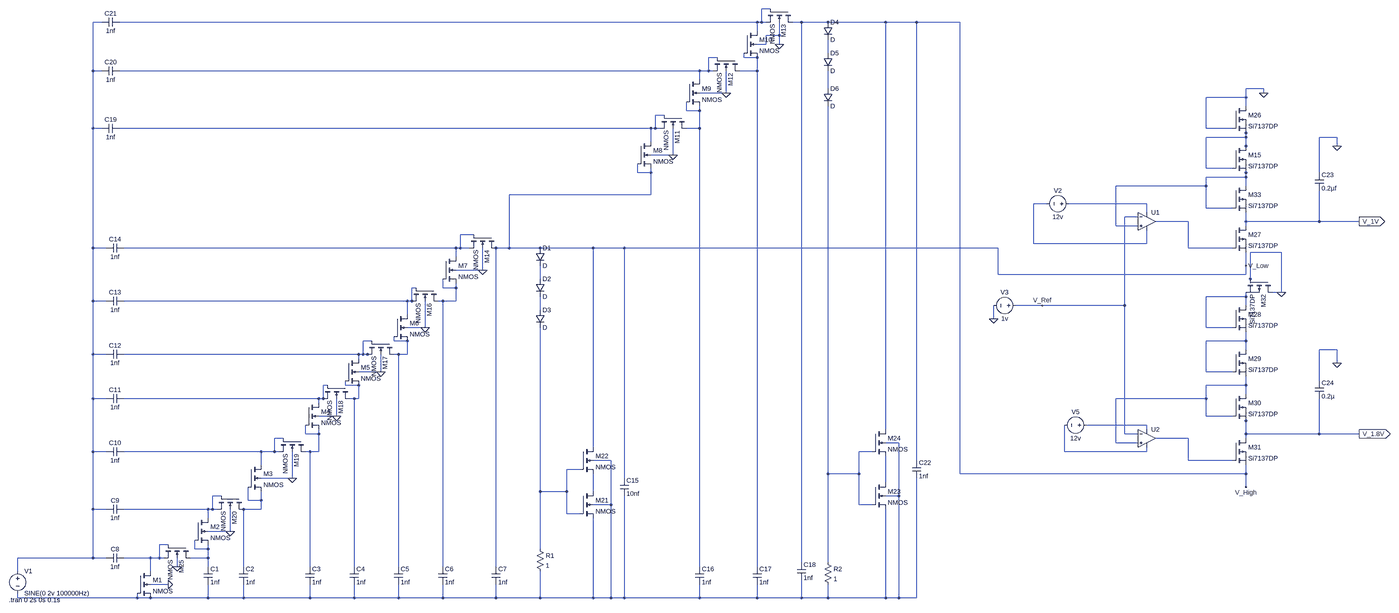
[diagram p0: schematic rectifier.asc, whole sheet]
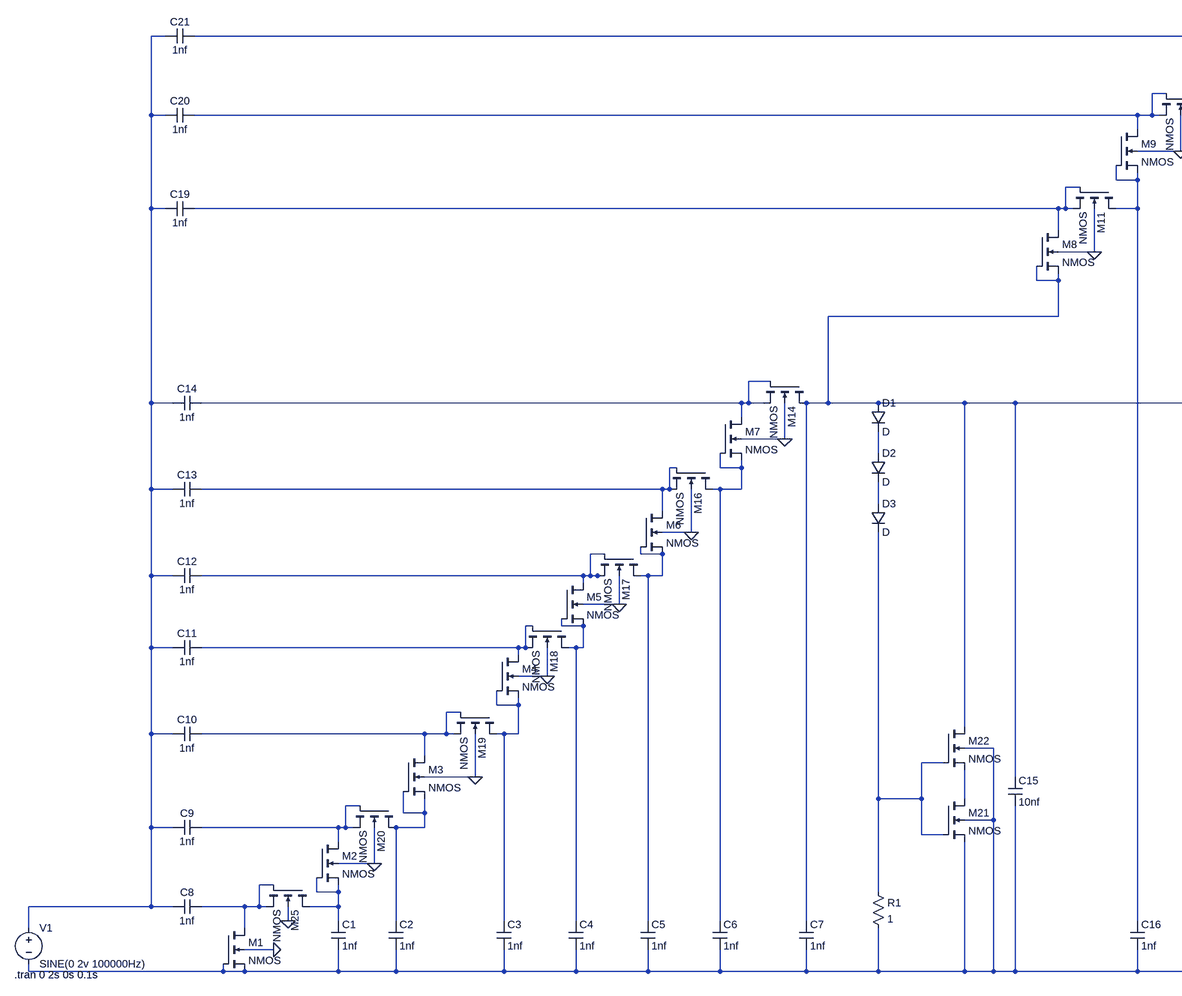
[diagram p1: schematic rectifier.asc, part, row 1 of 1, column 1 of 2]
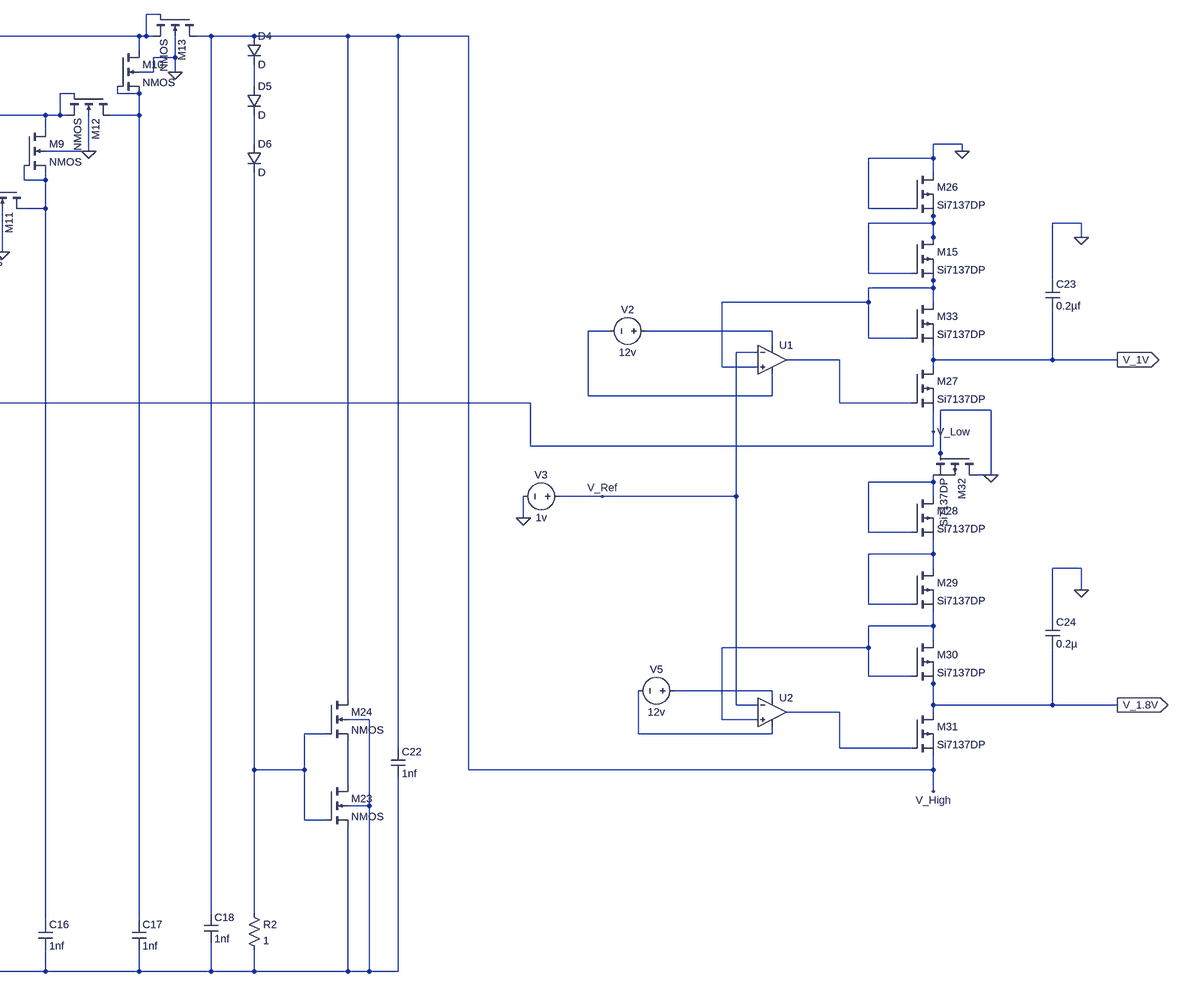
[diagram p2: schematic rectifier.asc, part, row 1 of 1, column 2 of 2]
rectifier.asc, the LTspice schematic file:
Version 4
SHEET 1 5596 680
WIRE 2400 -1856 2368 -1856
WIRE -16 -1808 -48 -1808
WIRE 2352 -1808 48 -1808
WIRE 2368 -1808 2368 -1856
WIRE 2368 -1808 2352 -1808
WIRE 2384 -1808 2368 -1808
WIRE 2512 -1808 2480 -1808
WIRE 2608 -1808 2512 -1808
WIRE 2816 -1808 2608 -1808
WIRE 2928 -1808 2816 -1808
WIRE 3376 -1808 2928 -1808
WIRE 2352 -1776 2352 -1808
WIRE 2432 -1760 2432 -1808
WIRE 2432 -1760 2384 -1760
WIRE 2384 -1728 2384 -1760
WIRE 2384 -1728 2352 -1728
WIRE 2432 -1728 2432 -1760
WIRE 2608 -1696 2608 -1744
WIRE 2208 -1680 2176 -1680
WIRE 2304 -1680 2304 -1696
WIRE 2352 -1680 2304 -1680
WIRE -48 -1632 -48 -1808
WIRE -16 -1632 -48 -1632
WIRE 2144 -1632 48 -1632
WIRE 2176 -1632 2176 -1680
WIRE 2176 -1632 2144 -1632
WIRE 2192 -1632 2176 -1632
WIRE 2352 -1632 2352 -1680
WIRE 2352 -1632 2288 -1632
WIRE 2144 -1600 2144 -1632
WIRE 2608 -1568 2608 -1632
WIRE 4752 -1568 4688 -1568
WIRE 2240 -1552 2240 -1632
WIRE 2240 -1552 2144 -1552
WIRE 4752 -1552 4752 -1568
WIRE 4688 -1536 4688 -1568
WIRE 4688 -1536 4544 -1536
WIRE 4688 -1504 4688 -1536
WIRE 2096 -1488 2096 -1520
WIRE 2144 -1488 2144 -1504
WIRE 2144 -1488 2096 -1488
WIRE 2016 -1472 1984 -1472
WIRE -48 -1424 -48 -1632
WIRE -16 -1424 -48 -1424
WIRE 1968 -1424 48 -1424
WIRE 1984 -1424 1984 -1472
WIRE 1984 -1424 1968 -1424
WIRE 2000 -1424 1984 -1424
WIRE 2144 -1424 2144 -1488
WIRE 2144 -1424 2096 -1424
WIRE 4544 -1424 4544 -1536
WIRE 4640 -1424 4544 -1424
WIRE 4688 -1408 4688 -1424
WIRE 4688 -1392 4688 -1408
WIRE 4688 -1392 4544 -1392
WIRE 5024 -1392 4960 -1392
WIRE 1968 -1376 1968 -1424
WIRE 4688 -1360 4688 -1392
WIRE 5024 -1360 5024 -1392
WIRE 4688 -1344 4688 -1360
WIRE 2048 -1328 2048 -1424
WIRE 2048 -1328 1968 -1328
WIRE 4544 -1280 4544 -1392
WIRE 4640 -1280 4544 -1280
WIRE 1920 -1264 1920 -1296
WIRE 1968 -1264 1968 -1280
WIRE 1968 -1264 1920 -1264
WIRE 4688 -1264 4688 -1280
WIRE 4960 -1264 4960 -1392
WIRE 4688 -1248 4688 -1264
WIRE 4688 -1248 4544 -1248
WIRE 4544 -1216 4544 -1248
WIRE 4544 -1216 4176 -1216
WIRE 4688 -1216 4688 -1248
WIRE 1968 -1184 1968 -1264
WIRE 1968 -1184 1456 -1184
WIRE 3920 -1152 3872 -1152
WIRE 4288 -1152 4000 -1152
WIRE 4544 -1136 4544 -1216
WIRE 4640 -1136 4544 -1136
WIRE 4288 -1120 4288 -1152
WIRE 4256 -1104 4208 -1104
WIRE 4480 -1088 4320 -1088
WIRE 4688 -1088 4688 -1120
WIRE 4960 -1088 4960 -1200
WIRE 4960 -1088 4688 -1088
WIRE 5104 -1088 4960 -1088
WIRE 4176 -1072 4176 -1216
WIRE 4256 -1072 4176 -1072
WIRE 4688 -1072 4688 -1088
WIRE 1328 -1040 1280 -1040
WIRE 3872 -1008 3872 -1152
WIRE 4288 -1008 4288 -1056
WIRE 4288 -1008 3872 -1008
WIRE -48 -992 -48 -1424
WIRE 0 -992 -48 -992
WIRE 1264 -992 64 -992
WIRE 1280 -992 1280 -1040
WIRE 1280 -992 1264 -992
WIRE 1312 -992 1280 -992
WIRE 1456 -992 1456 -1184
WIRE 1456 -992 1408 -992
WIRE 1568 -992 1456 -992
WIRE 1760 -992 1568 -992
WIRE 1872 -992 1760 -992
WIRE 3744 -992 1872 -992
WIRE 4480 -992 4480 -1088
WIRE 4640 -992 4480 -992
WIRE 4816 -976 4704 -976
WIRE 1264 -960 1264 -992
WIRE 4688 -928 4688 -976
WIRE 1360 -912 1360 -992
WIRE 1360 -912 1264 -912
WIRE 3744 -896 3744 -992
WIRE 4688 -896 4688 -928
WIRE 4688 -896 3744 -896
WIRE 1568 -880 1568 -928
WIRE 4704 -880 4704 -976
WIRE 4704 -864 4704 -880
WIRE 1120 -848 1104 -848
WIRE 1216 -848 1216 -880
WIRE 1264 -848 1264 -864
WIRE 1264 -848 1216 -848
WIRE 4816 -832 4816 -976
WIRE 4816 -832 4784 -832
WIRE 4688 -816 4688 -832
WIRE 4688 -816 4544 -816
WIRE -48 -800 -48 -992
WIRE 0 -800 -48 -800
WIRE 1088 -800 64 -800
WIRE 1104 -800 1104 -848
WIRE 1104 -800 1088 -800
WIRE 1216 -800 1200 -800
WIRE 1264 -800 1264 -848
WIRE 1264 -800 1216 -800
WIRE 3904 -784 3808 -784
WIRE 4208 -784 4208 -1104
WIRE 4208 -784 3904 -784
WIRE 4688 -784 4688 -816
WIRE 1568 -768 1568 -816
WIRE 1088 -752 1088 -800
WIRE 3728 -736 3728 -784
WIRE 1152 -704 1152 -800
WIRE 1152 -704 1088 -704
WIRE 4544 -704 4544 -816
WIRE 4640 -704 4544 -704
WIRE 960 -656 928 -656
WIRE 1040 -656 1040 -672
WIRE 1088 -656 1040 -656
WIRE 4688 -656 4688 -688
WIRE 4688 -656 4544 -656
WIRE 4688 -624 4688 -656
WIRE 5024 -624 4960 -624
WIRE -48 -608 -48 -800
WIRE 0 -608 -48 -608
WIRE 912 -608 64 -608
WIRE 928 -608 928 -656
WIRE 928 -608 912 -608
WIRE 944 -608 928 -608
WIRE 960 -608 944 -608
WIRE 1056 -608 1040 -608
WIRE 1088 -608 1088 -656
WIRE 1088 -608 1056 -608
WIRE 912 -592 912 -608
WIRE 5024 -576 5024 -624
WIRE 992 -544 992 -608
WIRE 992 -544 912 -544
WIRE 4544 -544 4544 -656
WIRE 4640 -544 4544 -544
WIRE 4960 -512 4960 -624
WIRE 800 -496 784 -496
WIRE 864 -496 864 -512
WIRE 912 -496 864 -496
WIRE 4688 -496 4688 -528
WIRE 4688 -496 4544 -496
WIRE 4688 -464 4688 -496
WIRE -48 -448 -48 -608
WIRE 0 -448 -48 -448
WIRE 768 -448 64 -448
WIRE 784 -448 784 -496
WIRE 784 -448 768 -448
WIRE 896 -448 880 -448
WIRE 912 -448 912 -496
WIRE 912 -448 896 -448
WIRE 4544 -448 4544 -496
WIRE 4544 -448 4176 -448
WIRE 768 -432 768 -448
WIRE 832 -384 832 -448
WIRE 832 -384 768 -384
WIRE 4544 -384 4544 -448
WIRE 4640 -384 4544 -384
WIRE 4688 -368 4688 -384
WIRE 4288 -352 4064 -352
WIRE 2816 -336 2816 -1808
WIRE 4288 -336 4288 -352
WIRE 720 -320 720 -352
WIRE 768 -320 768 -336
WIRE 768 -320 720 -320
WIRE 4208 -320 4208 -784
WIRE 4256 -320 4208 -320
WIRE 4688 -320 4688 -368
WIRE 4960 -320 4960 -448
WIRE 4960 -320 4688 -320
WIRE 5104 -320 4960 -320
WIRE 640 -304 608 -304
WIRE 4480 -304 4320 -304
WIRE 4688 -304 4688 -320
WIRE 2864 -288 2816 -288
WIRE 4176 -288 4176 -448
WIRE 4256 -288 4176 -288
WIRE 1760 -272 1760 -992
WIRE -48 -256 -48 -448
WIRE 0 -256 -48 -256
WIRE 560 -256 64 -256
WIRE 608 -256 608 -304
WIRE 608 -256 560 -256
WIRE 624 -256 608 -256
WIRE 736 -256 720 -256
WIRE 768 -256 768 -320
WIRE 768 -256 736 -256
WIRE 2768 -256 2720 -256
WIRE 3984 -256 3984 -352
WIRE 4288 -256 4288 -272
WIRE 4288 -256 3984 -256
WIRE 1824 -224 1760 -224
WIRE 2928 -224 2928 -1808
WIRE 4480 -224 4480 -304
WIRE 4640 -224 4480 -224
WIRE 560 -208 560 -256
WIRE 1712 -192 1664 -192
WIRE 2608 -176 2608 -1504
WIRE 2720 -176 2720 -256
WIRE 2720 -176 2608 -176
WIRE 3376 -176 3376 -1808
WIRE 4688 -176 4688 -208
WIRE 4688 -176 3376 -176
WIRE 672 -160 672 -256
WIRE 672 -160 560 -160
WIRE 1872 -160 1872 -992
WIRE 2816 -144 2816 -240
WIRE 4688 -128 4688 -176
WIRE 1568 -112 1568 -704
WIRE 1664 -112 1664 -192
WIRE 1664 -112 1568 -112
WIRE 1760 -112 1760 -176
WIRE 416 -96 384 -96
WIRE 2864 -96 2864 -288
WIRE 2864 -96 2816 -96
WIRE 512 -80 512 -128
WIRE 560 -80 560 -112
WIRE 560 -80 512 -80
WIRE 1824 -64 1824 -224
WIRE 1824 -64 1760 -64
WIRE 2720 -64 2720 -176
WIRE 2768 -64 2720 -64
WIRE -48 -48 -48 -256
WIRE 0 -48 -48 -48
WIRE 368 -48 64 -48
WIRE 384 -48 384 -96
WIRE 384 -48 368 -48
WIRE 400 -48 384 -48
WIRE 560 -48 560 -80
WIRE 560 -48 496 -48
WIRE 1664 -32 1664 -112
WIRE 1712 -32 1664 -32
WIRE 368 -16 368 -48
WIRE 448 32 448 -48
WIRE 448 32 368 32
WIRE 224 80 192 80
WIRE 320 96 320 64
WIRE 368 96 368 80
WIRE 368 96 320 96
WIRE 1568 96 1568 -112
WIRE -48 128 -48 -48
WIRE -48 128 -320 128
WIRE 0 128 -48 128
WIRE 160 128 64 128
WIRE 192 128 192 80
WIRE 192 128 160 128
WIRE 208 128 192 128
WIRE 368 128 368 96
WIRE 368 128 304 128
WIRE 2512 144 2512 -1808
WIRE 2608 144 2608 -176
WIRE 256 160 256 128
WIRE 368 160 368 128
WIRE 496 160 496 -48
WIRE 736 160 736 -256
WIRE 896 160 896 -448
WIRE 1056 160 1056 -608
WIRE 1216 160 1216 -800
WIRE 1408 160 1408 -992
WIRE 2144 160 2144 -1424
WIRE 2352 160 2352 -1632
WIRE -320 176 -320 128
WIRE 160 176 160 128
WIRE 224 224 160 224
WIRE -320 272 -320 256
WIRE 112 272 112 256
WIRE 112 272 -320 272
WIRE 160 272 112 272
WIRE 368 272 368 224
WIRE 368 272 160 272
WIRE 496 272 496 224
WIRE 496 272 368 272
WIRE 736 272 736 224
WIRE 736 272 496 272
WIRE 896 272 896 224
WIRE 896 272 736 272
WIRE 1056 272 1056 224
WIRE 1056 272 896 272
WIRE 1216 272 1216 224
WIRE 1216 272 1056 272
WIRE 1408 272 1408 224
WIRE 1408 272 1216 272
WIRE 1568 272 1568 176
WIRE 1568 272 1408 272
WIRE 1760 272 1760 -16
WIRE 1760 272 1568 272
WIRE 1824 272 1824 -64
WIRE 1824 272 1760 272
WIRE 1872 272 1872 -96
WIRE 1872 272 1824 272
WIRE 2144 272 2144 224
WIRE 2144 272 1872 272
WIRE 2352 272 2352 224
WIRE 2352 272 2144 272
WIRE 2512 272 2512 208
WIRE 2512 272 2352 272
WIRE 2608 272 2608 224
WIRE 2608 272 2512 272
WIRE 2816 272 2816 -48
WIRE 2816 272 2608 272
WIRE 2864 272 2864 -96
WIRE 2864 272 2816 272
WIRE 2928 272 2928 -160
WIRE 2928 272 2864 272
FLAG 256 160 0
FLAG 224 224 0
FLAG 1360 -912 0
FLAG 1152 -704 0
FLAG 992 -544 0
FLAG 832 -384 0
FLAG 672 -160 0
FLAG 448 32 0
FLAG 2240 -1552 0
FLAG 2048 -1328 0
FLAG 2432 -1728 0
FLAG 4752 -1552 0
FLAG 5024 -1360 0
FLAG 5024 -576 0
FLAG 4688 -128 V_High
FLAG 4688 -928 V_Low
FLAG 3904 -784 V_Ref
FLAG 5104 -320 V_1.8V
IOPIN 5104 -320 Out
FLAG 5104 -1088 V_1V
IOPIN 5104 -1088 Out
FLAG 3728 -736 0
FLAG 4816 -832 0
SYMBOL cap 352 160 R0
SYMATTR InstName C1
SYMATTR Value 1nf
SYMBOL cap 480 160 R0
SYMATTR InstName C2
SYMATTR Value 1nf
SYMBOL cap 720 160 R0
SYMATTR InstName C3
SYMATTR Value 1nf
SYMBOL cap 880 160 R0
SYMATTR InstName C4
SYMATTR Value 1nf
SYMBOL cap 1040 160 R0
SYMATTR InstName C5
SYMATTR Value 1nf
SYMBOL cap 1200 160 R0
SYMATTR InstName C6
SYMATTR Value 1nf
SYMBOL cap 1392 160 R0
SYMATTR InstName C7
SYMATTR Value 1nf
SYMBOL cap 64 112 R90
WINDOW 0 0 32 VBottom 2
WINDOW 3 32 32 VTop 2
SYMATTR InstName C8
SYMATTR Value 1nf
SYMBOL cap 64 -64 R90
WINDOW 0 0 32 VBottom 2
WINDOW 3 32 32 VTop 2
SYMATTR InstName C9
SYMATTR Value 1nf
SYMBOL cap 64 -272 R90
WINDOW 0 0 32 VBottom 2
WINDOW 3 32 32 VTop 2
SYMATTR InstName C10
SYMATTR Value 1nf
SYMBOL cap 64 -464 R90
WINDOW 0 0 32 VBottom 2
WINDOW 3 32 32 VTop 2
SYMATTR InstName C11
SYMATTR Value 1nf
SYMBOL cap 64 -624 R90
WINDOW 0 0 32 VBottom 2
WINDOW 3 32 32 VTop 2
SYMATTR InstName C12
SYMATTR Value 1nf
SYMBOL cap 64 -816 R90
WINDOW 0 0 32 VBottom 2
WINDOW 3 32 32 VTop 2
SYMATTR InstName C13
SYMATTR Value 1nf
SYMBOL cap 64 -1008 R90
WINDOW 0 0 32 VBottom 2
WINDOW 3 32 32 VTop 2
SYMATTR InstName C14
SYMATTR Value 1nf
SYMBOL diode 1552 -992 R0
SYMATTR InstName D1
SYMBOL diode 1552 -880 R0
SYMATTR InstName D2
SYMBOL diode 1552 -768 R0
SYMATTR InstName D3
SYMBOL res 1552 80 R0
SYMATTR InstName R1
SYMATTR Value 1
SYMBOL cap 1856 -160 R0
SYMATTR InstName C15
SYMATTR Value 10nf
SYMBOL cap 2128 160 R0
SYMATTR InstName C16
SYMATTR Value 1nf
SYMBOL cap 2336 160 R0
SYMATTR InstName C17
SYMATTR Value 1nf
SYMBOL cap 2496 144 R0
SYMATTR InstName C18
SYMATTR Value 1nf
SYMBOL cap 48 -1440 R90
WINDOW 0 0 32 VBottom 2
WINDOW 3 32 32 VTop 2
SYMATTR InstName C19
SYMATTR Value 1nf
SYMBOL cap 48 -1648 R90
WINDOW 0 0 32 VBottom 2
WINDOW 3 32 32 VTop 2
SYMATTR InstName C20
SYMATTR Value 1nf
SYMBOL cap 48 -1824 R90
WINDOW 0 0 32 VBottom 2
WINDOW 3 32 32 VTop 2
SYMATTR InstName C21
SYMATTR Value 1nf
SYMBOL diode 2592 -1808 R0
SYMATTR InstName D4
SYMBOL diode 2592 -1696 R0
SYMATTR InstName D5
SYMBOL diode 2592 -1568 R0
SYMATTR InstName D6
SYMBOL res 2592 128 R0
SYMATTR InstName R2
SYMATTR Value 1
SYMBOL cap 2912 -224 R0
SYMATTR InstName C22
SYMATTR Value 1nf
SYMBOL nmos4 112 176 R0
SYMATTR InstName M1
SYMBOL nmos4 320 -16 R0
SYMATTR InstName M2
SYMBOL nmos4 512 -208 R0
SYMATTR InstName M3
SYMBOL nmos4 720 -432 R0
SYMATTR InstName M4
SYMBOL nmos4 864 -592 R0
SYMATTR InstName M5
SYMBOL nmos4 1040 -752 R0
SYMATTR InstName M6
SYMBOL nmos4 1216 -960 R0
SYMATTR InstName M7
SYMBOL nmos4 1920 -1376 R0
SYMATTR InstName M8
SYMBOL nmos4 2096 -1600 R0
SYMATTR InstName M9
SYMBOL nmos4 2304 -1776 R0
SYMATTR InstName M10
SYMBOL nmos4 2096 -1472 R90
SYMATTR InstName M11
SYMBOL nmos4 2288 -1680 R90
SYMATTR InstName M12
SYMBOL nmos4 2480 -1856 R90
SYMATTR InstName M13
SYMBOL nmos4 1408 -1040 R90
SYMATTR InstName M14
SYMBOL nmos4 1200 -848 R90
SYMATTR InstName M16
SYMBOL nmos4 1040 -656 R90
SYMATTR InstName M17
SYMBOL nmos4 880 -496 R90
SYMATTR InstName M18
SYMBOL nmos4 720 -304 R90
SYMATTR InstName M19
SYMBOL nmos4 496 -96 R90
SYMATTR InstName M20
SYMBOL nmos4 304 80 R90
SYMATTR InstName M25
SYMBOL nmos4 1712 -112 R0
SYMATTR InstName M21
SYMBOL nmos4 1712 -272 R0
SYMATTR InstName M22
SYMBOL nmos4 2768 -144 R0
SYMATTR InstName M23
SYMBOL nmos4 2768 -336 R0
SYMATTR InstName M24
SYMBOL voltage -320 160 R0
WINDOW 123 0 0 Left 0
WINDOW 39 0 0 Left 0
SYMATTR InstName V1
SYMATTR Value SINE(0 2v 100000Hz)
SYMBOL cap 4944 -1264 R0
SYMATTR InstName C23
SYMATTR Value 0.2µf
SYMBOL cap 4944 -512 R0
SYMATTR InstName C24
SYMATTR Value 0.2µ
SYMBOL Opamps\\UniversalOpamp2 4288 -1088 R0
SYMATTR InstName U1
SYMBOL Opamps\\UniversalOpamp2 4288 -304 R0
SYMATTR InstName U2
SYMBOL voltage 4016 -1152 R90
WINDOW 0 -32 56 VBottom 2
WINDOW 3 32 56 VTop 2
WINDOW 123 0 0 Left 0
WINDOW 39 0 0 Left 0
SYMATTR InstName V2
SYMATTR Value 12v
SYMBOL voltage 4080 -352 R90
WINDOW 0 -32 56 VBottom 2
WINDOW 3 32 56 VTop 2
WINDOW 123 0 0 Left 0
WINDOW 39 0 0 Left 0
SYMATTR InstName V5
SYMATTR Value 12v
SYMBOL voltage 3824 -784 R90
WINDOW 0 -32 56 VBottom 2
WINDOW 3 32 56 VTop 2
WINDOW 123 0 0 Left 0
WINDOW 39 0 0 Left 0
SYMATTR InstName V3
SYMATTR Value 1v
SYMBOL pmos 4640 -1216 R0
SYMATTR InstName M33
SYMATTR Value Si7137DP
SYMBOL pmos 4640 -1072 R0
SYMATTR InstName M27
SYMATTR Value Si7137DP
SYMBOL pmos 4640 -784 R0
SYMATTR InstName M28
SYMATTR Value Si7137DP
SYMBOL pmos 4640 -624 R0
SYMATTR InstName M29
SYMATTR Value Si7137DP
SYMBOL pmos 4640 -464 R0
SYMATTR InstName M30
SYMATTR Value Si7137DP
SYMBOL pmos 4640 -304 R0
SYMATTR InstName M31
SYMATTR Value Si7137DP
SYMBOL pmos 4640 -1360 R0
SYMATTR InstName M15
SYMATTR Value Si7137DP
SYMBOL pmos 4640 -1504 R0
SYMATTR InstName M26
SYMATTR Value Si7137DP
SYMBOL pmos 4784 -880 R90
SYMATTR InstName M32
SYMATTR Value Si7137DP
TEXT -352 280 Left 2 !.tran 0 2s 0s 0.1s

The netlist it stands for:
* rectifier.asc
C1 N039 N030 1nf
C2 N037 N030 1nf
C3 N027 N030 1nf
C4 N024 N030 1nf
C5 N021 N030 1nf
C6 N017 N030 1nf
C7 V_Low N030 1nf
C8 N038 N002 1nf
C9 N036 N002 1nf
C10 N028 N002 1nf
C11 N023 N002 1nf
C12 N020 N002 1nf
C13 N016 N002 1nf
C14 N014 N002 1nf
D1 V_Low N015 D
D2 N015 N019 D
D3 N019 N033 D
R1 N033 N030 1
C15 V_Low N030 10nf
C16 N007 N030 1nf
C17 N005 N030 1nf
C18 V_High N030 1nf
C19 N008 N002 1nf
C20 N004 N002 1nf
C21 N001 N002 1nf
D4 V_High N003 D
D5 N003 N006 D
D6 N006 N031 D
R2 N031 N030 1
C22 V_High N030 1nf
M1 N038 N030 N030 0 NMOS
M2 N036 N039 N039 0 NMOS
M3 N028 N037 N037 0 NMOS
M4 N023 N027 N027 0 NMOS
M5 N020 N024 N024 0 NMOS
M6 N016 N021 N021 0 NMOS
M7 N014 N017 N017 0 NMOS
M8 N008 V_Low V_Low 0 NMOS
M9 N004 N007 N007 0 NMOS
M10 N001 N005 N005 0 NMOS
M11 N007 N008 N008 0 NMOS
M12 N005 N004 N004 0 NMOS
M13 V_High N001 N001 0 NMOS
M14 V_Low N014 N014 0 NMOS
M16 N017 N016 N016 0 NMOS
M17 N021 N020 N020 0 NMOS
M18 N024 N023 N023 0 NMOS
M19 N027 N028 N028 0 NMOS
M20 N037 N036 N036 0 NMOS
M25 N039 N038 N038 0 NMOS
M21 N035 N033 N030 N030 NMOS
M22 V_Low N033 N035 N030 NMOS
M23 N034 N031 N030 N030 NMOS
M24 V_High N031 N034 N030 NMOS
V1 N002 N030 SINE(0 2v 100000Hz)
C23 0 V_1V 0.2µf
C24 0 V_1.8V 0.2µ
XU1 N010 V_Ref N012 N011 N013 level.2 Avol=1Meg GBW=10Meg Slew=10Meg ilimit=25m rail=0 Vos=0 phimargin=45 en=0 enk=0 in=0 ink=0 Rin=500Meg  ; pins IN+ IN- V+ V- OUT
XU2 N025 V_Ref N026 N032 N029 level.2 Avol=1Meg GBW=10Meg Slew=10Meg ilimit=25m rail=0 Vos=0 phimargin=45 en=0 enk=0 in=0 ink=0 Rin=500Meg  ; pins IN+ IN- V+ V- OUT
V2 N012 N011 12v
V5 N026 N032 12v
V3 V_Ref 0 1v
M33 N010 N010 V_1V V_1V Si7137DP
M27 V_1V N013 V_Low V_Low Si7137DP
M28 N018 N018 N022 N022 Si7137DP
M29 N022 N022 N025 N025 Si7137DP
M30 N025 N025 V_1.8V V_1.8V Si7137DP
M31 V_1.8V N029 V_High V_High Si7137DP
M15 N009 N009 N010 N010 Si7137DP
M26 0 0 N009 N009 Si7137DP
M32 0 0 N018 N018 Si7137DP
.model D D
.lib standard.dio
.model NMOS NMOS
.model PMOS PMOS
.lib standard.mos
.tran 0 2s 0s 0.1s
.lib UniversalOpamps2.sub
.backanno
.end